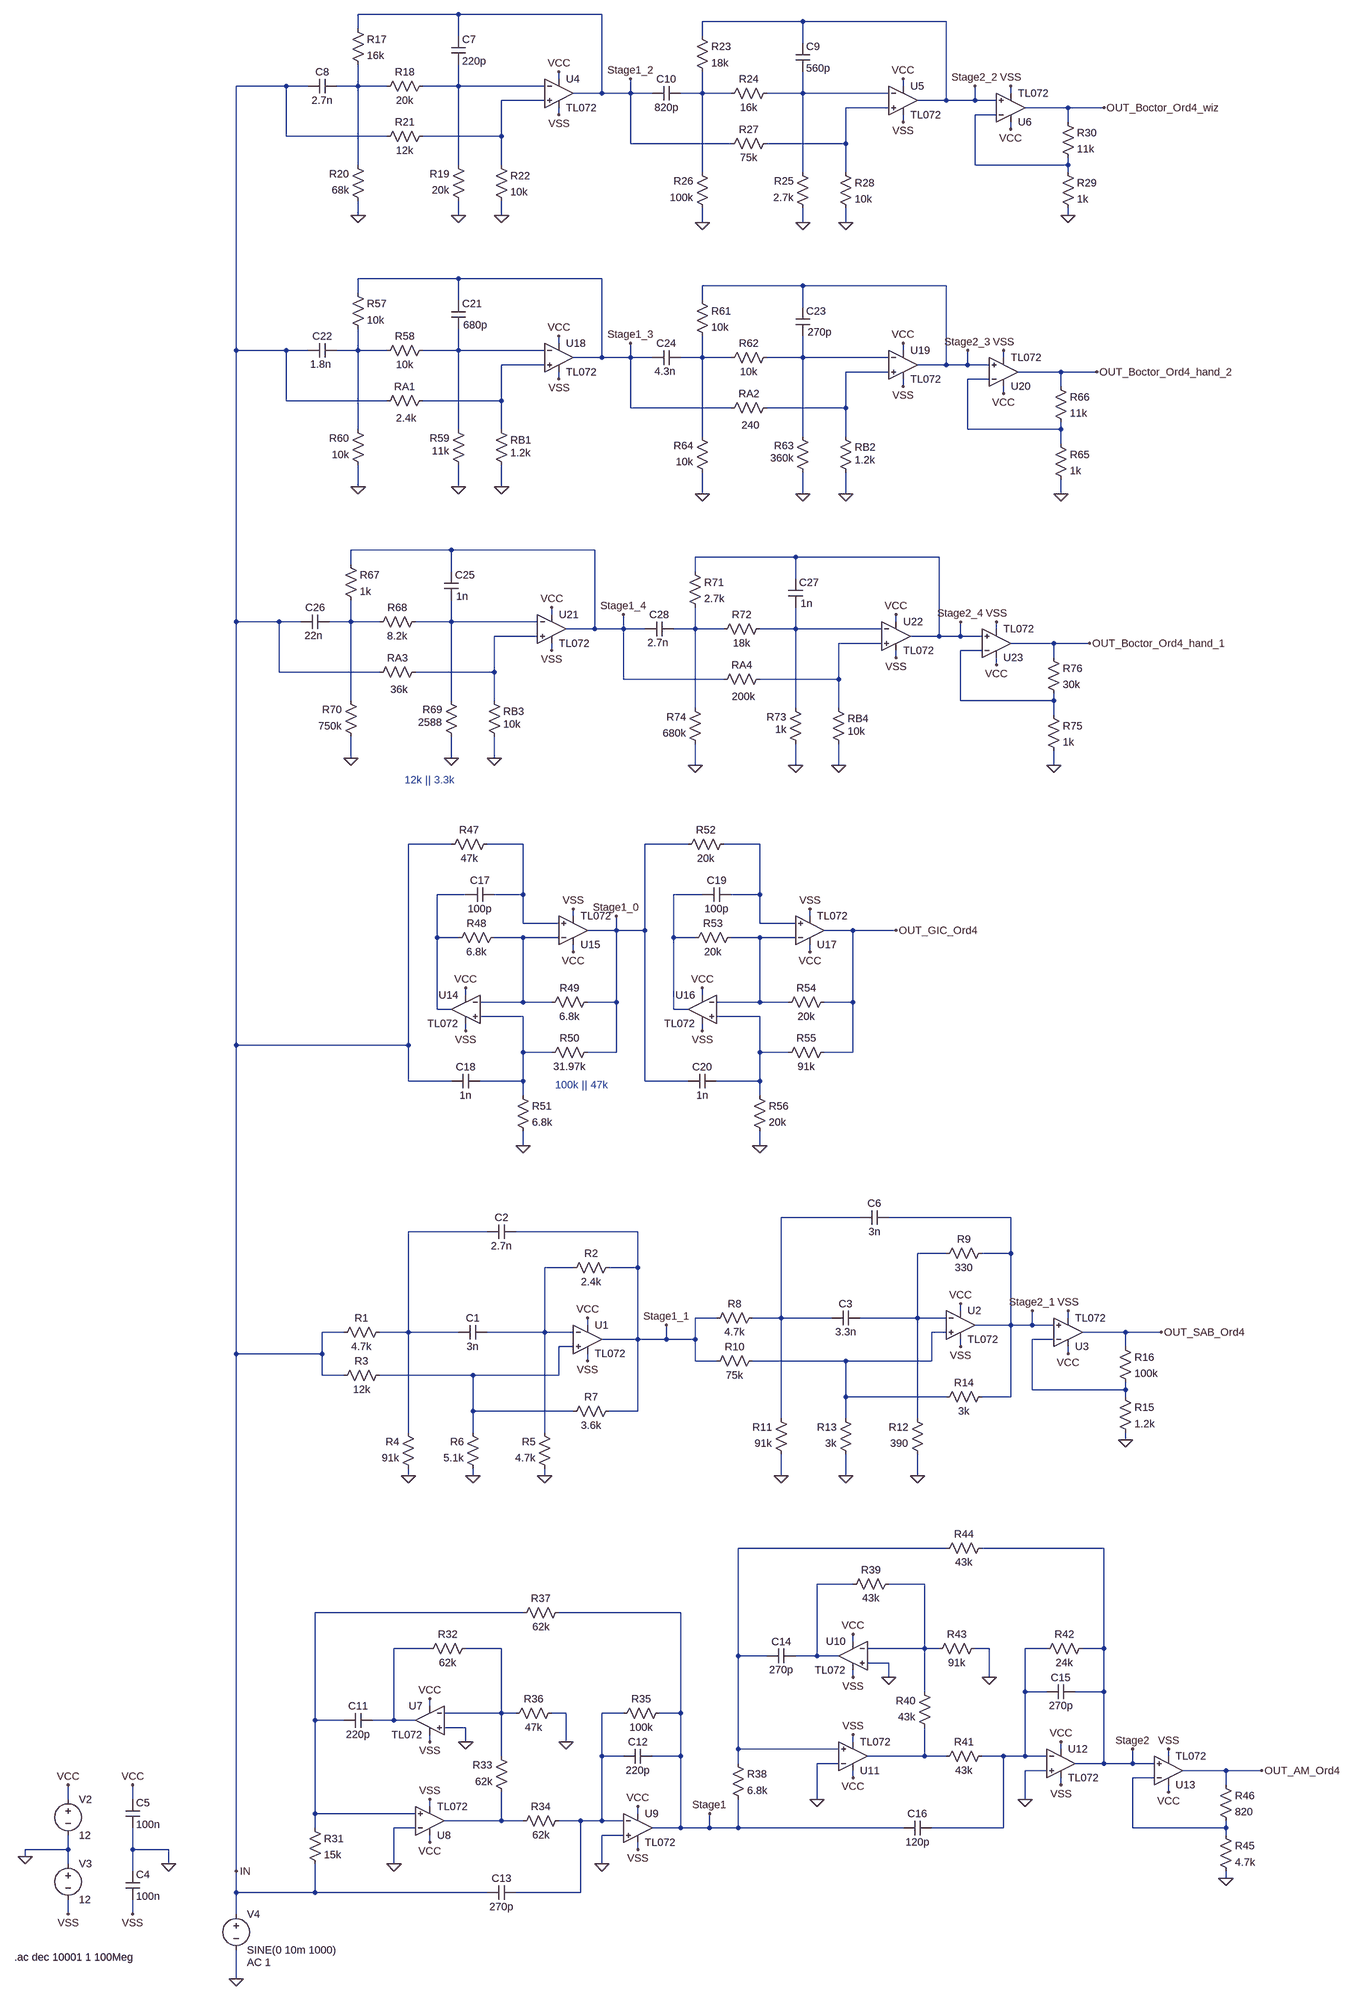
[diagram p0: schematic SAB_Boctor_AM_GIC_ordnung4_10kHz_1dB_30dB_inv_cheby.asc]
SAB_Boctor_AM_GIC_ordnung4_10kHz_1dB_30dB_inv_cheby.asc, the LTspice schematic file:
Version 4
SHEET 1 2564 2340
WIRE 480 -2208 256 -2208
WIRE 800 -2208 480 -2208
WIRE 1248 -2192 1024 -2192
WIRE 1568 -2192 1248 -2192
WIRE 256 -2176 256 -2208
WIRE 480 -2160 480 -2208
WIRE 1024 -2160 1024 -2192
WIRE 1248 -2144 1248 -2192
WIRE 704 -2064 704 -2080
WIRE 96 -2048 -16 -2048
WIRE 144 -2048 96 -2048
WIRE 256 -2048 256 -2096
WIRE 256 -2048 208 -2048
WIRE 320 -2048 256 -2048
WIRE 480 -2048 480 -2096
WIRE 480 -2048 400 -2048
WIRE 672 -2048 480 -2048
WIRE 1472 -2048 1472 -2064
WIRE 800 -2032 800 -2208
WIRE 800 -2032 736 -2032
WIRE 864 -2032 864 -2064
WIRE 864 -2032 800 -2032
WIRE 912 -2032 864 -2032
WIRE 1024 -2032 1024 -2080
WIRE 1024 -2032 976 -2032
WIRE 1088 -2032 1024 -2032
WIRE 1248 -2032 1248 -2080
WIRE 1248 -2032 1168 -2032
WIRE 1440 -2032 1248 -2032
WIRE 1712 -2032 1712 -2048
WIRE 672 -2016 576 -2016
WIRE 1568 -2016 1568 -2192
WIRE 1568 -2016 1504 -2016
WIRE 1632 -2016 1632 -2048
WIRE 1632 -2016 1568 -2016
WIRE 1680 -2016 1632 -2016
WIRE 1440 -2000 1344 -2000
WIRE 1840 -2000 1744 -2000
WIRE 1920 -2000 1840 -2000
WIRE 704 -1984 704 -2000
WIRE 1680 -1984 1632 -1984
WIRE 1472 -1968 1472 -1984
WIRE 1840 -1968 1840 -2000
WIRE 1712 -1952 1712 -1968
WIRE 96 -1936 96 -2048
WIRE 320 -1936 96 -1936
WIRE 576 -1936 576 -2016
WIRE 576 -1936 400 -1936
WIRE 864 -1920 864 -2032
WIRE 1088 -1920 864 -1920
WIRE 1344 -1920 1344 -2000
WIRE 1344 -1920 1168 -1920
WIRE 256 -1872 256 -2048
WIRE 480 -1872 480 -2048
WIRE 576 -1872 576 -1936
WIRE 1632 -1872 1632 -1984
WIRE 1840 -1872 1840 -1888
WIRE 1840 -1872 1632 -1872
WIRE 1024 -1856 1024 -2032
WIRE 1248 -1856 1248 -2032
WIRE 1344 -1856 1344 -1920
WIRE 1840 -1856 1840 -1872
WIRE 256 -1760 256 -1792
WIRE 480 -1760 480 -1792
WIRE 576 -1760 576 -1792
WIRE 1840 -1760 1840 -1776
WIRE 1024 -1744 1024 -1776
WIRE 1248 -1744 1248 -1776
WIRE 1344 -1744 1344 -1776
WIRE 480 -1552 256 -1552
WIRE 800 -1552 480 -1552
WIRE 1248 -1536 1024 -1536
WIRE 1568 -1536 1248 -1536
WIRE 256 -1520 256 -1552
WIRE 480 -1504 480 -1552
WIRE 1024 -1504 1024 -1536
WIRE 1248 -1488 1248 -1536
WIRE 704 -1408 704 -1424
WIRE -16 -1392 -16 -2048
WIRE 96 -1392 -16 -1392
WIRE 144 -1392 96 -1392
WIRE 256 -1392 256 -1440
WIRE 256 -1392 208 -1392
WIRE 320 -1392 256 -1392
WIRE 480 -1392 480 -1440
WIRE 480 -1392 400 -1392
WIRE 672 -1392 480 -1392
WIRE 1472 -1392 1472 -1408
WIRE 800 -1376 800 -1552
WIRE 800 -1376 736 -1376
WIRE 864 -1376 864 -1408
WIRE 864 -1376 800 -1376
WIRE 912 -1376 864 -1376
WIRE 1024 -1376 1024 -1424
WIRE 1024 -1376 976 -1376
WIRE 1088 -1376 1024 -1376
WIRE 1248 -1376 1248 -1424
WIRE 1248 -1376 1168 -1376
WIRE 1440 -1376 1248 -1376
WIRE 1696 -1376 1696 -1392
WIRE 672 -1360 576 -1360
WIRE 1568 -1360 1568 -1536
WIRE 1568 -1360 1504 -1360
WIRE 1616 -1360 1616 -1392
WIRE 1616 -1360 1568 -1360
WIRE 1664 -1360 1616 -1360
WIRE 1440 -1344 1344 -1344
WIRE 1824 -1344 1728 -1344
WIRE 1904 -1344 1824 -1344
WIRE 704 -1328 704 -1344
WIRE 1664 -1328 1616 -1328
WIRE 1472 -1312 1472 -1328
WIRE 1824 -1312 1824 -1344
WIRE 1696 -1296 1696 -1312
WIRE 96 -1280 96 -1392
WIRE 320 -1280 96 -1280
WIRE 576 -1280 576 -1360
WIRE 576 -1280 400 -1280
WIRE 864 -1264 864 -1376
WIRE 1088 -1264 864 -1264
WIRE 1344 -1264 1344 -1344
WIRE 1344 -1264 1168 -1264
WIRE 256 -1216 256 -1392
WIRE 480 -1216 480 -1392
WIRE 576 -1216 576 -1280
WIRE 1616 -1216 1616 -1328
WIRE 1824 -1216 1824 -1232
WIRE 1824 -1216 1616 -1216
WIRE 1024 -1200 1024 -1376
WIRE 1248 -1200 1248 -1376
WIRE 1344 -1200 1344 -1264
WIRE 1824 -1184 1824 -1216
WIRE 256 -1088 256 -1136
WIRE 480 -1088 480 -1136
WIRE 576 -1088 576 -1136
WIRE 1024 -1072 1024 -1120
WIRE 1248 -1072 1248 -1120
WIRE 1344 -1072 1344 -1120
WIRE 1824 -1072 1824 -1104
WIRE 464 -912 240 -912
WIRE 784 -912 464 -912
WIRE 1232 -896 1008 -896
WIRE 1552 -896 1232 -896
WIRE 240 -880 240 -912
WIRE 464 -864 464 -912
WIRE 1008 -864 1008 -896
WIRE 1232 -848 1232 -896
WIRE 688 -768 688 -784
WIRE -16 -752 -16 -1392
WIRE 80 -752 -16 -752
WIRE 128 -752 80 -752
WIRE 240 -752 240 -800
WIRE 240 -752 192 -752
WIRE 304 -752 240 -752
WIRE 464 -752 464 -800
WIRE 464 -752 384 -752
WIRE 656 -752 464 -752
WIRE 1456 -752 1456 -768
WIRE 784 -736 784 -912
WIRE 784 -736 720 -736
WIRE 848 -736 848 -768
WIRE 848 -736 784 -736
WIRE 896 -736 848 -736
WIRE 1008 -736 1008 -784
WIRE 1008 -736 960 -736
WIRE 1072 -736 1008 -736
WIRE 1232 -736 1232 -784
WIRE 1232 -736 1152 -736
WIRE 1424 -736 1232 -736
WIRE 1680 -736 1680 -752
WIRE 656 -720 560 -720
WIRE 1552 -720 1552 -896
WIRE 1552 -720 1488 -720
WIRE 1600 -720 1600 -752
WIRE 1600 -720 1552 -720
WIRE 1648 -720 1600 -720
WIRE 1424 -704 1328 -704
WIRE 1808 -704 1712 -704
WIRE 1888 -704 1808 -704
WIRE 688 -688 688 -704
WIRE 1648 -688 1600 -688
WIRE 1456 -672 1456 -688
WIRE 1808 -672 1808 -704
WIRE 1680 -656 1680 -672
WIRE 80 -640 80 -752
WIRE 304 -640 80 -640
WIRE 560 -640 560 -720
WIRE 560 -640 384 -640
WIRE 848 -624 848 -736
WIRE 1072 -624 848 -624
WIRE 1328 -624 1328 -704
WIRE 1328 -624 1152 -624
WIRE 240 -576 240 -752
WIRE 464 -576 464 -752
WIRE 560 -576 560 -640
WIRE 1600 -576 1600 -688
WIRE 1808 -576 1808 -592
WIRE 1808 -576 1600 -576
WIRE 1008 -560 1008 -736
WIRE 1232 -560 1232 -736
WIRE 1328 -560 1328 -624
WIRE 1808 -544 1808 -576
WIRE 240 -448 240 -496
WIRE 464 -448 464 -496
WIRE 560 -448 560 -496
WIRE 1008 -432 1008 -480
WIRE 1232 -432 1232 -480
WIRE 1328 -432 1328 -480
WIRE 1808 -432 1808 -464
WIRE 464 -256 368 -256
WIRE 624 -256 544 -256
WIRE 992 -256 896 -256
WIRE 1152 -256 1072 -256
WIRE 496 -144 432 -144
WIRE 624 -144 624 -256
WIRE 624 -144 560 -144
WIRE 1024 -144 960 -144
WIRE 1152 -144 1152 -256
WIRE 1152 -144 1088 -144
WIRE 736 -96 736 -112
WIRE 1264 -96 1264 -112
WIRE 624 -80 624 -144
WIRE 704 -80 624 -80
WIRE 1152 -80 1152 -144
WIRE 1232 -80 1152 -80
WIRE 832 -64 832 -96
WIRE 832 -64 768 -64
WIRE 896 -64 896 -256
WIRE 896 -64 832 -64
WIRE 1360 -64 1296 -64
WIRE 1456 -64 1360 -64
WIRE 432 -48 432 -144
WIRE 480 -48 432 -48
WIRE 624 -48 560 -48
WIRE 704 -48 624 -48
WIRE 960 -48 960 -144
WIRE 1008 -48 960 -48
WIRE 1152 -48 1088 -48
WIRE 1232 -48 1152 -48
WIRE 736 -16 736 -32
WIRE 1264 -16 1264 -32
WIRE 496 80 496 64
WIRE 1024 80 1024 64
WIRE 624 96 624 -48
WIRE 624 96 528 96
WIRE 688 96 624 96
WIRE 832 96 832 -64
WIRE 832 96 768 96
WIRE 1152 96 1152 -48
WIRE 1152 96 1056 96
WIRE 1216 96 1152 96
WIRE 1360 96 1360 -64
WIRE 1360 96 1296 96
WIRE 432 112 432 -48
WIRE 464 112 432 112
WIRE 960 112 960 -48
WIRE 992 112 960 112
WIRE 624 128 528 128
WIRE 1152 128 1056 128
WIRE 496 160 496 144
WIRE 1024 160 1024 144
WIRE -16 192 -16 -752
WIRE 368 192 368 -256
WIRE 368 192 -16 192
WIRE 624 208 624 128
WIRE 688 208 624 208
WIRE 832 208 832 96
WIRE 832 208 768 208
WIRE 1152 208 1152 128
WIRE 1216 208 1152 208
WIRE 1360 208 1360 96
WIRE 1360 208 1296 208
WIRE 368 272 368 192
WIRE 464 272 368 272
WIRE 624 272 624 208
WIRE 624 272 528 272
WIRE 896 272 896 -64
WIRE 992 272 896 272
WIRE 1152 272 1152 208
WIRE 1152 272 1056 272
WIRE 624 304 624 272
WIRE 1152 304 1152 272
WIRE 624 416 624 384
WIRE 1152 416 1152 384
WIRE 1376 576 1200 576
WIRE 1712 576 1440 576
WIRE 544 608 368 608
WIRE 880 608 608 608
WIRE 1568 656 1504 656
WIRE 1712 656 1712 576
WIRE 1712 656 1648 656
WIRE 736 688 672 688
WIRE 880 688 880 608
WIRE 880 688 816 688
WIRE 1600 784 1600 768
WIRE 1056 800 1008 800
WIRE 1200 800 1200 576
WIRE 1200 800 1136 800
WIRE 1312 800 1200 800
WIRE 1504 800 1504 656
WIRE 1504 800 1376 800
WIRE 1568 800 1504 800
WIRE 1840 800 1840 784
WIRE 768 816 768 800
WIRE 1712 816 1712 656
WIRE 1712 816 1632 816
WIRE 1760 816 1760 784
WIRE 1760 816 1712 816
WIRE 1808 816 1760 816
WIRE 224 832 176 832
WIRE 368 832 368 608
WIRE 368 832 304 832
WIRE 480 832 368 832
WIRE 672 832 672 688
WIRE 672 832 544 832
WIRE 736 832 672 832
WIRE 1568 832 1536 832
WIRE 1968 832 1872 832
WIRE 2048 832 1968 832
WIRE 880 848 880 688
WIRE 880 848 800 848
WIRE 944 848 944 816
WIRE 944 848 880 848
WIRE 1008 848 1008 800
WIRE 1008 848 944 848
WIRE 1808 848 1760 848
WIRE 736 864 704 864
WIRE 1600 864 1600 848
WIRE 1968 864 1968 832
WIRE -16 880 -16 192
WIRE 176 880 176 832
WIRE 176 880 -16 880
WIRE 1840 880 1840 864
WIRE 768 896 768 880
WIRE 1008 896 1008 848
WIRE 1056 896 1008 896
WIRE 1344 896 1136 896
WIRE 1536 896 1536 832
WIRE 1536 896 1344 896
WIRE 176 928 176 880
WIRE 224 928 176 928
WIRE 512 928 304 928
WIRE 704 928 704 864
WIRE 704 928 512 928
WIRE 1760 960 1760 848
WIRE 1968 960 1968 944
WIRE 1968 960 1760 960
WIRE 1344 976 1344 896
WIRE 1568 976 1344 976
WIRE 1712 976 1712 816
WIRE 1712 976 1648 976
WIRE 1968 976 1968 960
WIRE 512 1008 512 928
WIRE 736 1008 512 1008
WIRE 880 1008 880 848
WIRE 880 1008 816 1008
WIRE 1200 1024 1200 800
WIRE 1344 1024 1344 976
WIRE 1504 1024 1504 800
WIRE 368 1056 368 832
WIRE 512 1056 512 1008
WIRE 672 1056 672 832
WIRE 1968 1072 1968 1056
WIRE 368 1152 368 1136
WIRE 512 1152 512 1136
WIRE 672 1152 672 1136
WIRE 1200 1152 1200 1104
WIRE 1344 1152 1344 1104
WIRE 1504 1152 1504 1104
WIRE 1568 1360 1104 1360
WIRE 1920 1360 1648 1360
WIRE 1360 1440 1280 1440
WIRE 1520 1440 1440 1440
WIRE 624 1504 160 1504
WIRE 976 1504 704 1504
WIRE 1360 1568 1360 1552
WIRE 416 1584 336 1584
WIRE 576 1584 496 1584
WIRE 1520 1584 1520 1440
WIRE 1520 1584 1392 1584
WIRE 1552 1584 1520 1584
WIRE 1664 1584 1632 1584
WIRE 1792 1584 1744 1584
WIRE 1920 1584 1920 1360
WIRE 1920 1584 1872 1584
WIRE 1104 1600 1104 1360
WIRE 1168 1600 1104 1600
WIRE 1280 1600 1280 1440
WIRE 1280 1600 1232 1600
WIRE 1328 1600 1280 1600
WIRE 1440 1616 1392 1616
WIRE 1360 1648 1360 1632
WIRE 1440 1648 1440 1616
WIRE 1664 1648 1664 1584
WIRE 1520 1680 1520 1584
WIRE 1744 1680 1744 1584
WIRE 1792 1680 1744 1680
WIRE 1920 1680 1920 1584
WIRE 1920 1680 1856 1680
WIRE 416 1712 416 1696
WIRE 576 1728 576 1584
WIRE 576 1728 448 1728
WIRE 608 1728 576 1728
WIRE 720 1728 688 1728
WIRE 848 1728 800 1728
WIRE 976 1728 976 1504
WIRE 976 1728 928 1728
WIRE 160 1744 160 1504
WIRE 224 1744 160 1744
WIRE 336 1744 336 1584
WIRE 336 1744 288 1744
WIRE 384 1744 336 1744
WIRE 496 1760 448 1760
WIRE 416 1792 416 1776
WIRE 496 1792 496 1760
WIRE 720 1792 720 1728
WIRE 1360 1792 1360 1776
WIRE 1104 1808 1104 1600
WIRE 1328 1808 1104 1808
WIRE 1824 1808 1824 1792
WIRE 576 1824 576 1728
WIRE 800 1824 800 1728
WIRE 848 1824 800 1824
WIRE 976 1824 976 1728
WIRE 976 1824 912 1824
WIRE 1520 1824 1520 1760
WIRE 1520 1824 1392 1824
WIRE 1568 1824 1520 1824
WIRE 1696 1824 1648 1824
WIRE 1744 1824 1744 1680
WIRE 1744 1824 1696 1824
WIRE 1792 1824 1744 1824
WIRE 2064 1824 2064 1808
WIRE 1104 1840 1104 1808
WIRE 1328 1840 1280 1840
WIRE 1920 1840 1920 1680
WIRE 1920 1840 1856 1840
WIRE 1984 1840 1984 1808
WIRE 1984 1840 1920 1840
WIRE 2032 1840 1984 1840
WIRE 1792 1856 1744 1856
WIRE 2192 1856 2096 1856
WIRE 2272 1856 2192 1856
WIRE 1360 1872 1360 1856
WIRE 2032 1872 1984 1872
WIRE 1824 1888 1824 1872
WIRE 2192 1888 2192 1856
WIRE 2064 1904 2064 1888
WIRE -416 1920 -416 1888
WIRE -272 1920 -272 1888
WIRE 1280 1920 1280 1840
WIRE 1744 1920 1744 1856
WIRE 416 1936 416 1920
WIRE 160 1952 160 1744
WIRE 384 1952 160 1952
WIRE 880 1952 880 1936
WIRE 576 1968 576 1904
WIRE 576 1968 448 1968
WIRE 624 1968 576 1968
WIRE 752 1968 704 1968
WIRE 800 1968 800 1824
WIRE 800 1968 752 1968
WIRE 848 1968 800 1968
WIRE 160 1984 160 1952
WIRE 384 1984 336 1984
WIRE 976 1984 976 1824
WIRE 976 1984 912 1984
WIRE 1040 1984 1040 1952
WIRE 1040 1984 976 1984
WIRE 1104 1984 1104 1920
WIRE 1104 1984 1040 1984
WIRE 1472 1984 1104 1984
WIRE 1696 1984 1696 1824
WIRE 1696 1984 1536 1984
WIRE 1984 1984 1984 1872
WIRE 2192 1984 2192 1968
WIRE 2192 1984 1984 1984
WIRE 848 2000 800 2000
WIRE 2192 2000 2192 1984
WIRE 416 2016 416 2000
WIRE -416 2032 -416 2000
WIRE -416 2032 -512 2032
WIRE -272 2032 -272 1984
WIRE -192 2032 -272 2032
WIRE 880 2032 880 2016
WIRE -512 2048 -512 2032
WIRE -416 2064 -416 2032
WIRE -192 2064 -192 2032
WIRE 336 2064 336 1984
WIRE 800 2064 800 2000
WIRE -272 2080 -272 2032
WIRE -16 2080 -16 880
WIRE 2192 2096 2192 2080
WIRE -16 2128 -16 2080
WIRE 160 2128 160 2064
WIRE 160 2128 -16 2128
WIRE 544 2128 160 2128
WIRE 752 2128 752 1968
WIRE 752 2128 608 2128
WIRE -416 2176 -416 2144
WIRE -272 2176 -272 2144
WIRE -16 2176 -16 2128
WIRE -16 2320 -16 2256
FLAG -416 1888 VCC
FLAG -416 2176 VSS
FLAG -512 2048 0
FLAG -272 1888 VCC
FLAG -272 2176 VSS
FLAG -192 2064 0
FLAG 768 800 VCC
FLAG 768 896 VSS
FLAG 368 1152 0
FLAG 512 1152 0
FLAG 672 1152 0
FLAG 1600 768 VCC
FLAG 1600 864 VSS
FLAG 1200 1152 0
FLAG 1344 1152 0
FLAG 1504 1152 0
FLAG 944 816 Stage1_1
FLAG 1968 1072 0
FLAG 1840 784 VSS
FLAG 1840 880 VCC
FLAG 1760 784 Stage2_1
FLAG 2048 832 OUT_SAB_Ord4
FLAG 704 -2080 VCC
FLAG 704 -1984 VSS
FLAG 256 -1760 0
FLAG 480 -1760 0
FLAG 576 -1760 0
FLAG 1472 -2064 VCC
FLAG 1472 -1968 VSS
FLAG 1024 -1744 0
FLAG 1248 -1744 0
FLAG 1344 -1744 0
FLAG 864 -2064 Stage1_2
FLAG 1840 -1760 0
FLAG 1712 -2048 VSS
FLAG 1712 -1952 VCC
FLAG 1920 -2000 OUT_Boctor_Ord4_wiz
FLAG 1632 -2048 Stage2_2
FLAG -16 2320 0
FLAG -16 2080 IN
FLAG 416 1920 VSS
FLAG 416 1792 VSS
FLAG 880 2032 VSS
FLAG 416 1696 VCC
FLAG 416 2016 VCC
FLAG 880 1936 VCC
FLAG 800 2064 0
FLAG 336 2064 0
FLAG 496 1792 0
FLAG 720 1792 0
FLAG 1040 1952 Stage1
FLAG 1360 1776 VSS
FLAG 1360 1648 VSS
FLAG 1824 1888 VSS
FLAG 1360 1552 VCC
FLAG 1360 1872 VCC
FLAG 1824 1792 VCC
FLAG 1744 1920 0
FLAG 1280 1920 0
FLAG 1440 1648 0
FLAG 1664 1648 0
FLAG 2192 2096 0
FLAG 2064 1808 VSS
FLAG 2064 1904 VCC
FLAG 2272 1856 OUT_AM_Ord4
FLAG 1984 1808 Stage2
FLAG 496 64 VCC
FLAG 736 -16 VCC
FLAG 496 160 VSS
FLAG 736 -112 VSS
FLAG 624 416 0
FLAG 832 -96 Stage1_0
FLAG 1024 64 VCC
FLAG 1264 -16 VCC
FLAG 1024 160 VSS
FLAG 1264 -112 VSS
FLAG 1152 416 0
FLAG 1456 -64 OUT_GIC_Ord4
FLAG 704 -1424 VCC
FLAG 704 -1328 VSS
FLAG 256 -1088 0
FLAG 480 -1088 0
FLAG 576 -1088 0
FLAG 864 -1408 Stage1_3
FLAG 1472 -1408 VCC
FLAG 1472 -1312 VSS
FLAG 1024 -1072 0
FLAG 1248 -1072 0
FLAG 1344 -1072 0
FLAG 1824 -1072 0
FLAG 1696 -1392 VSS
FLAG 1696 -1296 VCC
FLAG 1904 -1344 OUT_Boctor_Ord4_hand_2
FLAG 1616 -1392 Stage2_3
FLAG 688 -784 VCC
FLAG 688 -688 VSS
FLAG 240 -448 0
FLAG 464 -448 0
FLAG 560 -448 0
FLAG 848 -768 Stage1_4
FLAG 1456 -768 VCC
FLAG 1456 -672 VSS
FLAG 1008 -432 0
FLAG 1232 -432 0
FLAG 1328 -432 0
FLAG 1808 -432 0
FLAG 1680 -752 VSS
FLAG 1680 -656 VCC
FLAG 1888 -704 OUT_Boctor_Ord4_hand_1
FLAG 1600 -752 Stage2_4
SYMBOL voltage -416 1904 R0
WINDOW 123 0 0 Left 0
WINDOW 39 0 0 Left 0
SYMATTR InstName V2
SYMATTR Value 12
SYMBOL voltage -416 2048 R0
WINDOW 123 0 0 Left 0
WINDOW 39 0 0 Left 0
SYMATTR InstName V3
SYMATTR Value 12
SYMBOL cap -288 1920 R0
SYMATTR InstName C5
SYMATTR Value 100n
SYMBOL cap -288 2080 R0
SYMATTR InstName C4
SYMATTR Value 100n
SYMBOL res 320 816 R90
WINDOW 0 0 56 VBottom 2
WINDOW 3 32 56 VTop 2
SYMATTR InstName R1
SYMATTR Value 4.7k
SYMBOL res 832 672 R90
WINDOW 0 0 56 VBottom 2
WINDOW 3 32 56 VTop 2
SYMATTR InstName R2
SYMATTR Value 2.4k
SYMBOL res 320 912 R90
WINDOW 0 0 56 VBottom 2
WINDOW 3 32 56 VTop 2
SYMATTR InstName R3
SYMATTR Value 12k
SYMBOL res 384 1152 R180
WINDOW 0 36 76 Left 2
WINDOW 3 36 40 Left 2
SYMATTR InstName R4
SYMATTR Value 91k
SYMBOL res 688 1152 R180
WINDOW 0 36 76 Left 2
WINDOW 3 36 40 Left 2
SYMATTR InstName R5
SYMATTR Value 4.7k
SYMBOL res 528 1152 R180
WINDOW 0 36 76 Left 2
WINDOW 3 36 40 Left 2
SYMATTR InstName R6
SYMATTR Value 5.1k
SYMBOL cap 544 816 R90
WINDOW 0 0 32 VBottom 2
WINDOW 3 32 32 VTop 2
SYMATTR InstName C1
SYMATTR Value 3n
SYMBOL cap 608 592 R90
WINDOW 0 0 32 VBottom 2
WINDOW 3 32 32 VTop 2
SYMATTR InstName C2
SYMATTR Value 2.7n
SYMBOL TL072 768 784 R0
SYMATTR InstName U1
SYMBOL res 832 992 R90
WINDOW 0 0 56 VBottom 2
WINDOW 3 32 56 VTop 2
SYMATTR InstName R7
SYMATTR Value 3.6k
SYMBOL res 1152 784 R90
WINDOW 0 0 56 VBottom 2
WINDOW 3 32 56 VTop 2
SYMATTR InstName R8
SYMATTR Value 4.7k
SYMBOL res 1664 640 R90
WINDOW 0 0 56 VBottom 2
WINDOW 3 32 56 VTop 2
SYMATTR InstName R9
SYMATTR Value 330
SYMBOL res 1152 880 R90
WINDOW 0 0 56 VBottom 2
WINDOW 3 32 56 VTop 2
SYMATTR InstName R10
SYMATTR Value 75k
SYMBOL res 1216 1120 R180
WINDOW 0 36 76 Left 2
WINDOW 3 36 40 Left 2
SYMATTR InstName R11
SYMATTR Value 91k
SYMBOL res 1520 1120 R180
WINDOW 0 36 76 Left 2
WINDOW 3 36 40 Left 2
SYMATTR InstName R12
SYMATTR Value 390
SYMBOL res 1360 1120 R180
WINDOW 0 36 76 Left 2
WINDOW 3 36 40 Left 2
SYMATTR InstName R13
SYMATTR Value 3k
SYMBOL cap 1376 784 R90
WINDOW 0 0 32 VBottom 2
WINDOW 3 32 32 VTop 2
SYMATTR InstName C3
SYMATTR Value 3.3n
SYMBOL cap 1440 560 R90
WINDOW 0 0 32 VBottom 2
WINDOW 3 32 32 VTop 2
SYMATTR InstName C6
SYMATTR Value 3n
SYMBOL TL072 1600 752 R0
SYMATTR InstName U2
SYMBOL res 1664 960 R90
WINDOW 0 0 56 VBottom 2
WINDOW 3 32 56 VTop 2
SYMATTR InstName R14
SYMATTR Value 3k
SYMBOL res 1952 960 R0
SYMATTR InstName R15
SYMATTR Value 1.2k
SYMBOL res 1952 848 R0
SYMATTR InstName R16
SYMATTR Value 100k
SYMBOL TL072 1840 896 M180
SYMATTR InstName U3
SYMBOL res 240 -2192 R0
SYMATTR InstName R17
SYMATTR Value 16k
SYMBOL res 416 -2064 R90
WINDOW 0 0 56 VBottom 2
WINDOW 3 32 56 VTop 2
SYMATTR InstName R18
SYMATTR Value 20k
SYMBOL res 496 -1776 R180
WINDOW 0 36 76 Left 2
WINDOW 3 36 40 Left 2
SYMATTR InstName R19
SYMATTR Value 20k
SYMBOL res 272 -1776 R180
WINDOW 0 36 76 Left 2
WINDOW 3 36 40 Left 2
SYMATTR InstName R20
SYMATTR Value 68k
SYMBOL res 304 -1920 R270
WINDOW 0 32 56 VTop 2
WINDOW 3 0 56 VBottom 2
SYMATTR InstName R21
SYMATTR Value 12k
SYMBOL res 560 -1888 R0
SYMATTR InstName R22
SYMATTR Value 10k
SYMBOL cap 464 -2160 R0
SYMATTR InstName C7
SYMATTR Value 220p
SYMBOL cap 208 -2064 R90
WINDOW 0 0 32 VBottom 2
WINDOW 3 32 32 VTop 2
SYMATTR InstName C8
SYMATTR Value 2.7n
SYMBOL TL072 704 -2096 R0
SYMATTR InstName U4
SYMBOL res 1008 -2176 R0
SYMATTR InstName R23
SYMATTR Value 18k
SYMBOL res 1184 -2048 R90
WINDOW 0 0 56 VBottom 2
WINDOW 3 32 56 VTop 2
SYMATTR InstName R24
SYMATTR Value 16k
SYMBOL res 1264 -1760 R180
WINDOW 0 36 76 Left 2
WINDOW 3 36 40 Left 2
SYMATTR InstName R25
SYMATTR Value 2.7k
SYMBOL res 1040 -1760 R180
WINDOW 0 36 76 Left 2
WINDOW 3 36 40 Left 2
SYMATTR InstName R26
SYMATTR Value 100k
SYMBOL res 1072 -1904 R270
WINDOW 0 32 56 VTop 2
WINDOW 3 0 56 VBottom 2
SYMATTR InstName R27
SYMATTR Value 75k
SYMBOL res 1328 -1872 R0
SYMATTR InstName R28
SYMATTR Value 10k
SYMBOL cap 1232 -2144 R0
SYMATTR InstName C9
SYMATTR Value 560p
SYMBOL cap 976 -2048 R90
WINDOW 0 0 32 VBottom 2
WINDOW 3 32 32 VTop 2
SYMATTR InstName C10
SYMATTR Value 820p
SYMBOL TL072 1472 -2080 R0
SYMATTR InstName U5
SYMBOL res 1824 -1872 R0
SYMATTR InstName R29
SYMATTR Value 1k
SYMBOL res 1824 -1984 R0
SYMATTR InstName R30
SYMATTR Value 11k
SYMBOL TL072 1712 -1936 M180
SYMATTR InstName U6
SYMBOL voltage -16 2160 R0
WINDOW 123 24 124 Left 2
WINDOW 39 0 0 Left 0
SYMATTR Value2 AC 1
SYMATTR InstName V4
SYMATTR Value SINE(0 10m 1000)
SYMBOL TL072 416 1680 M0
SYMATTR InstName U7
SYMBOL TL072 416 2032 M180
SYMATTR InstName U8
SYMBOL TL072 880 1920 R0
SYMATTR InstName U9
SYMBOL res 144 1968 R0
SYMATTR InstName R31
SYMATTR Value 15k
SYMBOL res 512 1568 R90
WINDOW 0 0 56 VBottom 2
WINDOW 3 32 56 VTop 2
SYMATTR InstName R32
SYMATTR Value 62k
SYMBOL res 592 1920 R180
WINDOW 0 36 76 Left 2
WINDOW 3 36 40 Left 2
SYMATTR InstName R33
SYMATTR Value 62k
SYMBOL res 608 1984 R270
WINDOW 0 32 56 VTop 2
WINDOW 3 0 56 VBottom 2
SYMATTR InstName R34
SYMATTR Value 62k
SYMBOL res 832 1744 R270
WINDOW 0 32 56 VTop 2
WINDOW 3 0 56 VBottom 2
SYMATTR InstName R35
SYMATTR Value 100k
SYMBOL res 592 1744 R270
WINDOW 0 32 56 VTop 2
WINDOW 3 0 56 VBottom 2
SYMATTR InstName R36
SYMATTR Value 47k
SYMBOL res 608 1520 R270
WINDOW 0 32 56 VTop 2
WINDOW 3 0 56 VBottom 2
SYMATTR InstName R37
SYMATTR Value 62k
SYMBOL cap 288 1728 R90
WINDOW 0 0 32 VBottom 2
WINDOW 3 32 32 VTop 2
SYMATTR InstName C11
SYMATTR Value 220p
SYMBOL cap 912 1808 R90
WINDOW 0 0 32 VBottom 2
WINDOW 3 32 32 VTop 2
SYMATTR InstName C12
SYMATTR Value 220p
SYMBOL cap 608 2112 R90
WINDOW 0 0 32 VBottom 2
WINDOW 3 32 32 VTop 2
SYMATTR InstName C13
SYMATTR Value 270p
SYMBOL TL072 1360 1536 M0
SYMATTR InstName U10
SYMBOL TL072 1360 1888 M180
SYMATTR InstName U11
SYMBOL TL072 1824 1776 R0
SYMATTR InstName U12
SYMBOL res 1088 1824 R0
SYMATTR InstName R38
SYMATTR Value 6.8k
SYMBOL res 1456 1424 R90
WINDOW 0 0 56 VBottom 2
WINDOW 3 32 56 VTop 2
SYMATTR InstName R39
SYMATTR Value 43k
SYMBOL res 1536 1776 R180
WINDOW 0 36 76 Left 2
WINDOW 3 36 40 Left 2
SYMATTR InstName R40
SYMATTR Value 43k
SYMBOL res 1552 1840 R270
WINDOW 0 32 56 VTop 2
WINDOW 3 0 56 VBottom 2
SYMATTR InstName R41
SYMATTR Value 43k
SYMBOL res 1776 1600 R270
WINDOW 0 32 56 VTop 2
WINDOW 3 0 56 VBottom 2
SYMATTR InstName R42
SYMATTR Value 24k
SYMBOL res 1536 1600 R270
WINDOW 0 32 56 VTop 2
WINDOW 3 0 56 VBottom 2
SYMATTR InstName R43
SYMATTR Value 91k
SYMBOL res 1552 1376 R270
WINDOW 0 32 56 VTop 2
WINDOW 3 0 56 VBottom 2
SYMATTR InstName R44
SYMATTR Value 43k
SYMBOL cap 1232 1584 R90
WINDOW 0 0 32 VBottom 2
WINDOW 3 32 32 VTop 2
SYMATTR InstName C14
SYMATTR Value 270p
SYMBOL cap 1856 1664 R90
WINDOW 0 0 32 VBottom 2
WINDOW 3 32 32 VTop 2
SYMATTR InstName C15
SYMATTR Value 270p
SYMBOL cap 1536 1968 R90
WINDOW 0 0 32 VBottom 2
WINDOW 3 32 32 VTop 2
SYMATTR InstName C16
SYMATTR Value 120p
SYMBOL res 2176 1984 R0
SYMATTR InstName R45
SYMATTR Value 4.7k
SYMBOL res 2176 1872 R0
SYMATTR InstName R46
SYMATTR Value 820
SYMBOL TL072 2064 1920 M180
SYMATTR InstName U13
SYMBOL TL072 496 48 M0
SYMATTR InstName U14
SYMBOL TL072 736 0 M180
SYMATTR InstName U15
SYMBOL res 560 -272 R90
WINDOW 0 0 56 VBottom 2
WINDOW 3 32 56 VTop 2
SYMATTR InstName R47
SYMATTR Value 47k
SYMBOL res 576 -64 R90
WINDOW 0 0 56 VBottom 2
WINDOW 3 32 56 VTop 2
SYMATTR InstName R48
SYMATTR Value 6.8k
SYMBOL res 784 80 R90
WINDOW 0 0 56 VBottom 2
WINDOW 3 32 56 VTop 2
SYMATTR InstName R49
SYMATTR Value 6.8k
SYMBOL res 784 192 R90
WINDOW 0 0 56 VBottom 2
WINDOW 3 32 56 VTop 2
SYMATTR InstName R50
SYMATTR Value 31.97k
SYMBOL res 608 288 R0
SYMATTR InstName R51
SYMATTR Value 6.8k
SYMBOL cap 560 -160 R90
WINDOW 0 0 32 VBottom 2
WINDOW 3 32 32 VTop 2
SYMATTR InstName C17
SYMATTR Value 100p
SYMBOL cap 528 256 R90
WINDOW 0 0 32 VBottom 2
WINDOW 3 32 32 VTop 2
SYMATTR InstName C18
SYMATTR Value 1n
SYMBOL TL072 1024 48 M0
SYMATTR InstName U16
SYMBOL TL072 1264 0 M180
SYMATTR InstName U17
SYMBOL res 1088 -272 R90
WINDOW 0 0 56 VBottom 2
WINDOW 3 32 56 VTop 2
SYMATTR InstName R52
SYMATTR Value 20k
SYMBOL res 1104 -64 R90
WINDOW 0 0 56 VBottom 2
WINDOW 3 32 56 VTop 2
SYMATTR InstName R53
SYMATTR Value 20k
SYMBOL res 1312 80 R90
WINDOW 0 0 56 VBottom 2
WINDOW 3 32 56 VTop 2
SYMATTR InstName R54
SYMATTR Value 20k
SYMBOL res 1312 192 R90
WINDOW 0 0 56 VBottom 2
WINDOW 3 32 56 VTop 2
SYMATTR InstName R55
SYMATTR Value 91k
SYMBOL res 1136 288 R0
SYMATTR InstName R56
SYMATTR Value 20k
SYMBOL cap 1088 -160 R90
WINDOW 0 0 32 VBottom 2
WINDOW 3 32 32 VTop 2
SYMATTR InstName C19
SYMATTR Value 100p
SYMBOL cap 1056 256 R90
WINDOW 0 0 32 VBottom 2
WINDOW 3 32 32 VTop 2
SYMATTR InstName C20
SYMATTR Value 1n
SYMBOL res 240 -1536 R0
SYMATTR InstName R57
SYMATTR Value 10k
SYMBOL res 416 -1408 R90
WINDOW 0 0 56 VBottom 2
WINDOW 3 32 56 VTop 2
SYMATTR InstName R58
SYMATTR Value 10k
SYMBOL res 496 -1120 R180
WINDOW 0 36 76 Left 2
WINDOW 3 36 48 Left 2
SYMATTR InstName R59
SYMATTR Value 11k
SYMBOL res 272 -1120 R180
WINDOW 0 36 76 Left 2
WINDOW 3 36 40 Left 2
SYMATTR InstName R60
SYMATTR Value 10k
SYMBOL res 304 -1264 R270
WINDOW 0 32 56 VTop 2
WINDOW 3 -38 60 VTop 2
SYMATTR InstName RA1
SYMATTR Value 2.4k
SYMBOL res 560 -1232 R0
WINDOW 3 36 68 Left 2
SYMATTR Value 1.2k
SYMATTR InstName RB1
SYMBOL cap 464 -1504 R0
WINDOW 3 27 55 Left 2
SYMATTR Value 680p
SYMATTR InstName C21
SYMBOL cap 208 -1408 R90
WINDOW 0 0 32 VBottom 2
WINDOW 3 62 35 VBottom 2
SYMATTR InstName C22
SYMATTR Value 1.8n
SYMBOL TL072 704 -1440 R0
SYMATTR InstName U18
SYMBOL res 1008 -1520 R0
SYMATTR InstName R61
SYMATTR Value 10k
SYMBOL res 1184 -1392 R90
WINDOW 0 0 56 VBottom 2
WINDOW 3 32 56 VTop 2
SYMATTR InstName R62
SYMATTR Value 10k
SYMBOL res 1264 -1104 R180
WINDOW 0 36 76 Left 2
WINDOW 3 36 48 Left 2
SYMATTR InstName R63
SYMATTR Value 360k
SYMBOL res 1040 -1104 R180
WINDOW 0 36 76 Left 2
WINDOW 3 36 40 Left 2
SYMATTR InstName R64
SYMATTR Value 10k
SYMBOL res 1072 -1248 R270
WINDOW 0 32 56 VTop 2
WINDOW 3 -38 60 VTop 2
SYMATTR InstName RA2
SYMATTR Value 240
SYMBOL res 1328 -1216 R0
WINDOW 3 36 68 Left 2
SYMATTR Value 1.2k
SYMATTR InstName RB2
SYMBOL cap 1232 -1488 R0
WINDOW 3 27 55 Left 2
SYMATTR Value 270p
SYMATTR InstName C23
SYMBOL cap 976 -1392 R90
WINDOW 0 0 32 VBottom 2
WINDOW 3 62 35 VBottom 2
SYMATTR InstName C24
SYMATTR Value 4.3n
SYMBOL TL072 1472 -1424 R0
SYMATTR InstName U19
SYMBOL res 1808 -1200 R0
SYMATTR InstName R65
SYMATTR Value 1k
SYMBOL res 1808 -1328 R0
SYMATTR InstName R66
SYMATTR Value 11k
SYMBOL TL072 1696 -1280 M180
SYMATTR InstName U20
SYMBOL res 224 -896 R0
SYMATTR InstName R67
SYMATTR Value 1k
SYMBOL res 400 -768 R90
WINDOW 0 0 56 VBottom 2
WINDOW 3 32 56 VTop 2
SYMATTR InstName R68
SYMATTR Value 8.2k
SYMBOL res 480 -480 R180
WINDOW 0 36 76 Left 2
WINDOW 3 36 48 Left 2
SYMATTR InstName R69
SYMATTR Value 2588
SYMBOL res 256 -480 R180
WINDOW 0 36 76 Left 2
WINDOW 3 36 40 Left 2
SYMATTR InstName R70
SYMATTR Value 750k
SYMBOL res 288 -624 R270
WINDOW 0 32 56 VTop 2
WINDOW 3 -38 60 VTop 2
SYMATTR InstName RA3
SYMATTR Value 36k
SYMBOL res 544 -592 R0
WINDOW 3 36 68 Left 2
SYMATTR Value 10k
SYMATTR InstName RB3
SYMBOL cap 448 -864 R0
WINDOW 3 27 55 Left 2
SYMATTR Value 1n
SYMATTR InstName C25
SYMBOL cap 192 -768 R90
WINDOW 0 0 32 VBottom 2
WINDOW 3 62 35 VBottom 2
SYMATTR InstName C26
SYMATTR Value 22n
SYMBOL TL072 688 -800 R0
SYMATTR InstName U21
SYMBOL res 992 -880 R0
SYMATTR InstName R71
SYMATTR Value 2.7k
SYMBOL res 1168 -752 R90
WINDOW 0 0 56 VBottom 2
WINDOW 3 32 56 VTop 2
SYMATTR InstName R72
SYMATTR Value 18k
SYMBOL res 1248 -464 R180
WINDOW 0 36 76 Left 2
WINDOW 3 36 48 Left 2
SYMATTR InstName R73
SYMATTR Value 1k
SYMBOL res 1024 -464 R180
WINDOW 0 36 76 Left 2
WINDOW 3 36 40 Left 2
SYMATTR InstName R74
SYMATTR Value 680k
SYMBOL res 1056 -608 R270
WINDOW 0 32 56 VTop 2
WINDOW 3 -38 60 VTop 2
SYMATTR InstName RA4
SYMATTR Value 200k
SYMBOL res 1312 -576 R0
WINDOW 3 36 68 Left 2
SYMATTR Value 10k
SYMATTR InstName RB4
SYMBOL cap 1216 -848 R0
WINDOW 3 27 55 Left 2
SYMATTR Value 1n
SYMATTR InstName C27
SYMBOL cap 960 -752 R90
WINDOW 0 0 32 VBottom 2
WINDOW 3 62 35 VBottom 2
SYMATTR InstName C28
SYMATTR Value 2.7n
SYMBOL TL072 1456 -784 R0
SYMATTR InstName U22
SYMBOL res 1792 -560 R0
SYMATTR InstName R75
SYMATTR Value 1k
SYMBOL res 1792 -688 R0
SYMATTR InstName R76
SYMATTR Value 30k
SYMBOL TL072 1680 -640 M180
SYMATTR InstName U23
TEXT -536 2272 Left 2 !.ac dec 10001 1 100Meg
TEXT 696 280 Left 2 ;100k || 47k
TEXT 360 -400 Left 2 ;12k || 3.3k

The netlist it stands for:
* SAB_Boctor_AM_GIC_ordnung4_10kHz_1dB_30dB_inv_cheby.asc
V2 VCC 0 12
V3 0 VSS 12
C5 VCC 0 100n
C4 0 VSS 100n
R1 N031 IN 4.7k
R2 Stage1_1 N033 2.4k
R3 N036 IN 12k
R4 0 N031 91k
R5 0 N033 4.7k
R6 0 N036 5.1k
C1 N033 N031 3n
C2 Stage1_1 N031 2.7n
* U1: TL072 (symbol TL072 not available, pins judged from their places): In+=N036 In-=N033 V+=VCC V-=VSS OUT=Stage1_1
R7 Stage1_1 N036 3.6k
R8 N030 Stage1_1 4.7k
R9 Stage2_1 N032 330
R10 N034 Stage1_1 75k
R11 0 N030 91k
R12 0 N032 390
R13 0 N034 3k
C3 N032 N030 3.3n
C6 Stage2_1 N030 3n
* U2: TL072 (symbol TL072 not available, pins judged from their places): In+=N034 In-=N032 V+=VCC V-=VSS OUT=Stage2_1
R14 Stage2_1 N034 3k
R15 N035 0 1.2k
R16 OUT_SAB_Ord4 N035 100k
* U3: TL072 (symbol TL072 not available, pins judged from their places): In+=Stage2_1 In-=N035 V+=VCC V-=VSS OUT=OUT_SAB_Ord4
R17 Stage1_2 N001 16k
R18 N002 N001 20k
R19 0 N002 20k
R20 0 N001 68k
R21 IN N005 12k
R22 N005 0 10k
C7 Stage1_2 N002 220p
C8 N001 IN 2.7n
* U4: TL072 (symbol TL072 not available, pins judged from their places): In+=N005 In-=N002 V+=VCC V-=VSS OUT=Stage1_2
R23 Stage2_2 N003 18k
R24 N004 N003 16k
R25 0 N004 2.7k
R26 0 N003 100k
R27 Stage1_2 N006 75k
R28 N006 0 10k
C9 Stage2_2 N004 560p
C10 N003 Stage1_2 820p
* U5: TL072 (symbol TL072 not available, pins judged from their places): In+=N006 In-=N004 V+=VCC V-=VSS OUT=Stage2_2
R29 N007 0 1k
R30 OUT_Boctor_Ord4_wiz N007 11k
* U6: TL072 (symbol TL072 not available, pins judged from their places): In+=Stage2_2 In-=N007 V+=VCC V-=VSS OUT=OUT_Boctor_Ord4_wiz
V4 IN 0 SINE(0 10m 1000) AC 1
* U7: TL072 (symbol TL072 not available, pins judged from their places): In+=0 In-=N042 V+=VCC V-=VSS OUT=N041
* U8: TL072 (symbol TL072 not available, pins judged from their places): In+=N040 In-=0 V+=VCC V-=VSS OUT=N047
* U9: TL072 (symbol TL072 not available, pins judged from their places): In+=0 In-=N044 V+=VCC V-=VSS OUT=Stage1
R31 N040 IN 15k
R32 N042 N041 62k
R33 N047 N042 62k
R34 N047 N044 62k
R35 N044 Stage1 100k
R36 N042 0 47k
R37 N040 Stage1 62k
C11 N041 N040 220p
C12 Stage1 N044 220p
C13 N044 IN 270p
* U10: TL072 (symbol TL072 not available, pins judged from their places): In+=0 In-=N039 V+=VCC V-=VSS OUT=N038
* U11: TL072 (symbol TL072 not available, pins judged from their places): In+=N037 In-=0 V+=VCC V-=VSS OUT=N045
* U12: TL072 (symbol TL072 not available, pins judged from their places): In+=0 In-=N043 V+=VCC V-=VSS OUT=Stage2
R38 N037 Stage1 6.8k
R39 N039 N038 43k
R40 N045 N039 43k
R41 N045 N043 43k
R42 N043 Stage2 24k
R43 N039 0 91k
R44 N037 Stage2 43k
C14 N038 N037 270p
C15 Stage2 N043 270p
C16 N043 Stage1 120p
R45 N046 0 4.7k
R46 OUT_AM_Ord4 N046 820
* U13: TL072 (symbol TL072 not available, pins judged from their places): In+=Stage2 In-=N046 V+=VCC V-=VSS OUT=OUT_AM_Ord4
* U14: TL072 (symbol TL072 not available, pins judged from their places): In+=N028 In-=N026 V+=VCC V-=VSS OUT=N024
* U15: TL072 (symbol TL072 not available, pins judged from their places): In+=N022 In-=N026 V+=VCC V-=VSS OUT=Stage1_0
R47 N022 IN 47k
R48 N026 N024 6.8k
R49 Stage1_0 N026 6.8k
R50 Stage1_0 N028 31.97k
R51 N028 0 6.8k
C17 N022 N024 100p
C18 N028 IN 1n
* U16: TL072 (symbol TL072 not available, pins judged from their places): In+=N029 In-=N027 V+=VCC V-=VSS OUT=N025
* U17: TL072 (symbol TL072 not available, pins judged from their places): In+=N023 In-=N027 V+=VCC V-=VSS OUT=OUT_GIC_Ord4
R52 N023 Stage1_0 20k
R53 N027 N025 20k
R54 OUT_GIC_Ord4 N027 20k
R55 OUT_GIC_Ord4 N029 91k
R56 N029 0 20k
C19 N023 N025 100p
C20 N029 Stage1_0 1n
R57 Stage1_3 N008 10k
R58 N009 N008 10k
R59 0 N009 11k
R60 0 N008 10k
RA1 IN N012 2.4k
RB1 N012 0 1.2k
C21 Stage1_3 N009 680p
C22 N008 IN 1.8n
* U18: TL072 (symbol TL072 not available, pins judged from their places): In+=N012 In-=N009 V+=VCC V-=VSS OUT=Stage1_3
R61 Stage2_3 N010 10k
R62 N011 N010 10k
R63 0 N011 360k
R64 0 N010 10k
RA2 Stage1_3 N013 240
RB2 N013 0 1.2k
C23 Stage2_3 N011 270p
C24 N010 Stage1_3 4.3n
* U19: TL072 (symbol TL072 not available, pins judged from their places): In+=N013 In-=N011 V+=VCC V-=VSS OUT=Stage2_3
R65 N014 0 1k
R66 OUT_Boctor_Ord4_hand_2 N014 11k
* U20: TL072 (symbol TL072 not available, pins judged from their places): In+=Stage2_3 In-=N014 V+=VCC V-=VSS OUT=OUT_Boctor_Ord4_hand_2
R67 Stage1_4 N015 1k
R68 N016 N015 8.2k
R69 0 N016 2588
R70 0 N015 750k
RA3 IN N019 36k
RB3 N019 0 10k
C25 Stage1_4 N016 1n
C26 N015 IN 22n
* U21: TL072 (symbol TL072 not available, pins judged from their places): In+=N019 In-=N016 V+=VCC V-=VSS OUT=Stage1_4
R71 Stage2_4 N017 2.7k
R72 N018 N017 18k
R73 0 N018 1k
R74 0 N017 680k
RA4 Stage1_4 N020 200k
RB4 N020 0 10k
C27 Stage2_4 N018 1n
C28 N017 Stage1_4 2.7n
* U22: TL072 (symbol TL072 not available, pins judged from their places): In+=N020 In-=N018 V+=VCC V-=VSS OUT=Stage2_4
R75 N021 0 1k
R76 OUT_Boctor_Ord4_hand_1 N021 30k
* U23: TL072 (symbol TL072 not available, pins judged from their places): In+=Stage2_4 In-=N021 V+=VCC V-=VSS OUT=OUT_Boctor_Ord4_hand_1
.ac dec 10001 1 100Meg
* 100k || 47k
* 12k || 3.3k
.backanno
.end